# Altium schematic sheet SlotCarControllerRev1.SchDoc
size B; Author: T Delbruck; CompanyName: INI; DrawnBy: T Delbruck; Engineer: T Delbruck; Organization: INI; Address1: tobi@ini.phys.ethz.ch; DocumentName: SimpleMonitorUSBXPress
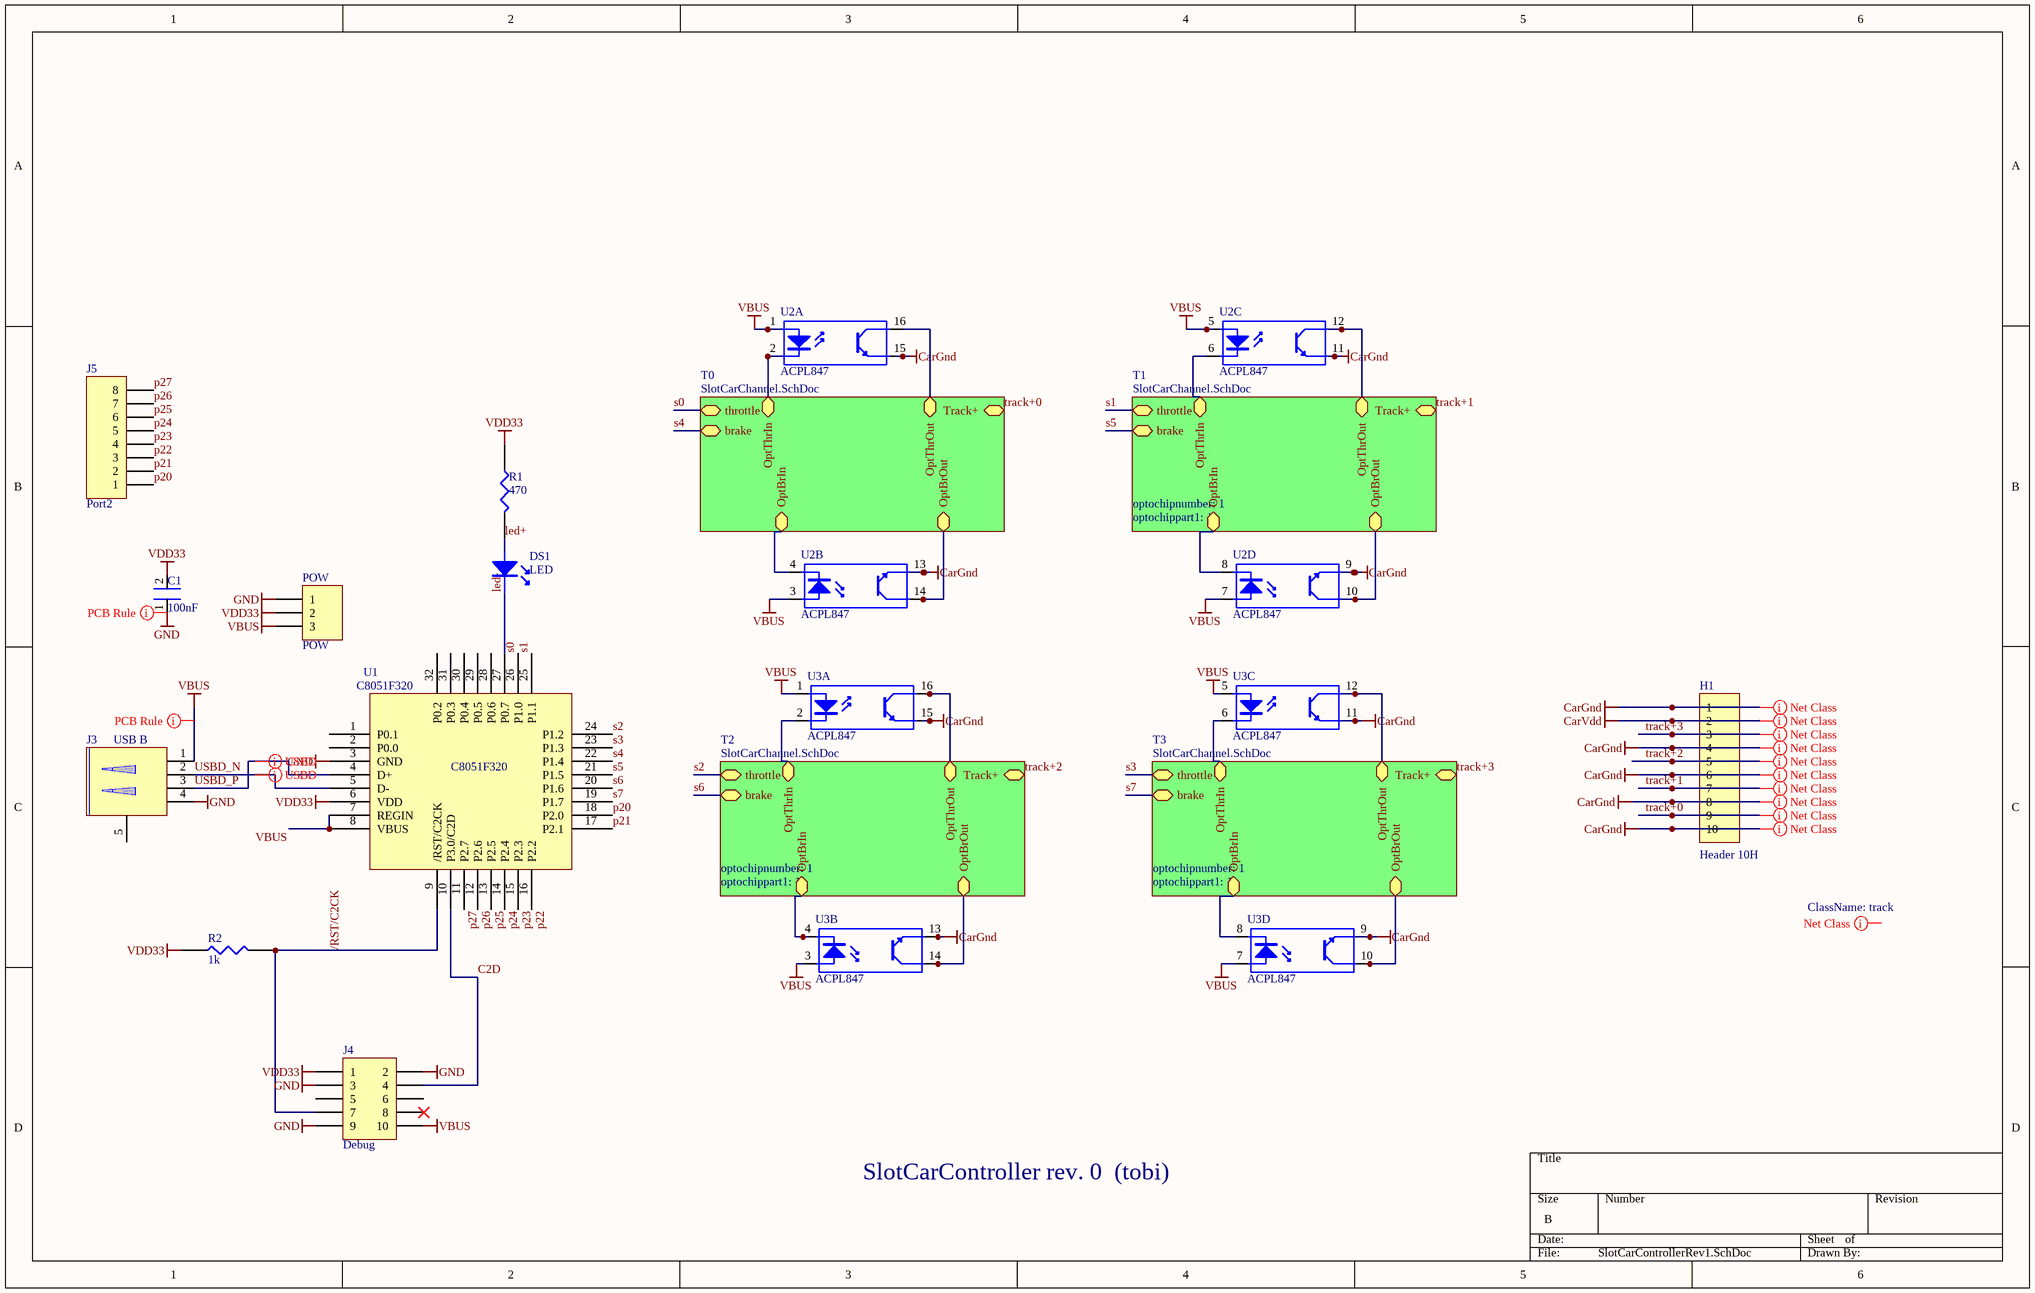
[diagram p0: SlotCarControllerRev1.SchDoc]

## Parts
C1  100nF  [CC1608-0603]
DS1  LED  [0805LED]
H1  Header 10H  [SL508/10/90]
J3  USB B  [usb]
J4  Debug  [HDR2X5]
J5  Port2  [HDR1X8]
POW  POW  [HDR1X3]
R1  470  [CR1608-0603]
R2  1k  [CR1608-0603]
U1  C8051F320  [TQFP32]
U2  ACPL847  [DIP16]  (parts A,B,C,D of 4)
U3  ACPL847  [DIP16]  (parts A,B,C,D of 4)

## Sub-sheets
T0 = SlotCarChannel.SchDoc: throttle, brake, Track+, OptThrIn, OptThrOut, OptBrIn, OptBrOut
T1 = SlotCarChannel.SchDoc: throttle, brake, Track+, OptThrIn, OptThrOut, OptBrIn, OptBrOut  | optochipnumber: 1; optochippart1: 1
T2 = SlotCarChannel.SchDoc: throttle, brake, Track+, OptThrIn, OptThrOut, OptBrIn, OptBrOut  | optochipnumber: 1; optochippart1: 1
T3 = SlotCarChannel.SchDoc: throttle, brake, Track+, OptThrIn, OptThrOut, OptBrIn, OptBrOut  | optochipnumber: 1; optochippart1: 1

## Nets
CarGnd: H1.1 H1.4 H1.6 H1.8 H1.10 U2.9 U2.11 U2.13 U2.15 U3.9 U3.11 U3.13 U3.15
CarVdd: H1.2
GND: C1.1 J3.4 J4.2 J4.3 J4.9 POW.1 U1.3(GND)
VBUS: J3.1 J4.10 POW.3 U1.7(REGIN) U1.8(VBUS) U2.1(A) U2.3 U2.5 U2.7 U3.1(A) U3.3 U3.5 U3.7
VDD33: C1.2 J4.1 POW.2 R1.1 R2.1 U1.6(VDD)
/RST/C2CK: J4.7 R2.2 U1.9(/RST/C2CK)
C2D: J4.4 U1.10(P3.0/C2D)
led+: DS1.+ R1.2
led-: DS1.- U1.27(P0.7)
p20: J5.1 U1.18(P2.0)
p21: J5.2 U1.17(P2.1)
p22: J5.3 U1.16(P2.2)
p23: J5.4 U1.15(P2.3)
p24: J5.5 U1.14(P2.4)
p25: J5.6 U1.13(P2.5)
p26: J5.7 U1.12(P2.6)
p27: J5.8 U1.11(P2.7)
s0: U1.26(P1.0) ; sheet T0/throttle
s1: U1.25(P1.1) ; sheet T1/throttle
s2: U1.24(P1.2) ; sheet T2/throttle
s3: U1.23(P1.3) ; sheet T3/throttle
s4: U1.22(P1.4) ; sheet T0/brake
s5: U1.21(P1.5) ; sheet T1/brake
s6: U1.20(P1.6) ; sheet T2/brake
s7: U1.19(P1.7) ; sheet T3/brake
track+0: H1.9 ; sheet T0/Track+
track+1: H1.7 ; sheet T1/Track+
track+2: H1.5 ; sheet T2/Track+
track+3: H1.3 ; sheet T3/Track+
USBD_N: J3.2 U1.5(D-)
USBD_P: J3.3 U1.4(D+)
NetU2_2: U2.2(K) ; sheet T0/OptThrIn
NetU2_4: U2.4 ; sheet T0/OptBrIn
NetU2_6: U2.6 ; sheet T1/OptThrIn
NetU2_8: U2.8 ; sheet T1/OptBrIn
NetU2_10: U2.10 ; sheet T1/OptBrOut
NetU2_12: U2.12 ; sheet T1/OptThrOut
NetU2_14: U2.14 ; sheet T0/OptBrOut
NetU2_16: U2.16 ; sheet T0/OptThrOut
NetU3_2: U3.2(K) ; sheet T2/OptThrIn
NetU3_4: U3.4 ; sheet T2/OptBrIn
NetU3_6: U3.6 ; sheet T3/OptThrIn
NetU3_8: U3.8 ; sheet T3/OptBrIn
NetU3_10: U3.10 ; sheet T3/OptBrOut
NetU3_12: U3.12 ; sheet T3/OptThrOut
NetU3_14: U3.14 ; sheet T2/OptBrOut
NetU3_16: U3.16 ; sheet T2/OptThrOut

Not connected (* = marked no-connect by the designer): J3 5; J4 5 6 8*; U1 1(P0.1) 2(P0.0) 28(P0.6) 29(P0.5) 30(P0.4) 31(P0.3) 32(P0.2)

## Layout directives
rule Width Constraint [Pref Width = 20mil    Min Width = 10mil    Max Width = 60mil]: GND, VBUS
net class track; rule Undefined: (no net found under the mark), CarGnd, CarVdd, track+0, track+1, track+2, track+3
net class track: CarGnd
differential pair; rule Differential Pairs Routing [Pref Gap = 10mil    Min Gap  = 10mil    Max Gap  = 10mil]: USBD_P
differential pair; rule Undefined: USBD_N

## Notes on the sheet
- SlotCarController rev. 0  (tobi)

## Library data of the parts
C1 = CAPCHIP
DS1 = LED: LED, SMT 3mm by 1.5mm
H1 = Header 10H: Header, 10-Pin, Right Angle; LatestRevisionDate: 17-Jul-2002; LatestRevisionNote: Re-released for DXP Platform.; Publisher: Altium Limited
J3 = USB: USB TypB
J4 = Header 5X2: Header, 5-Pin, Dual row; Revision: 17-Jul-2002: Re-released for DXP Platform.; Publisher: Altium Limited
J5 = Header 8: Header, 8-Pin; Revision: 17-Jul-2002: Re-released for DXP Platform.; Publisher: Altium Limited
POW = Header 3: Header, 3-Pin; Revision: 17-Jul-2002: Re-released for DXP Platform.; Publisher: Altium Limited
R1 R2 = RES1
U1 = C8051F320: Silicon Labs USB Microcontroller
U2 U3 = Opto16: 16-Pin 4-channel Phototransistor Optocoupler; Published: 24-Mar-1999; LatestRevisionDate: 04-Mar-2005; LatestRevisionNote: Sch pins 3 & 4 Swapped.; DatasheetDocument: Nov-2003; PackageReference: DIP-16; Publisher: tobi